# EAGLE design network driver (EAGLE 6.5.0)
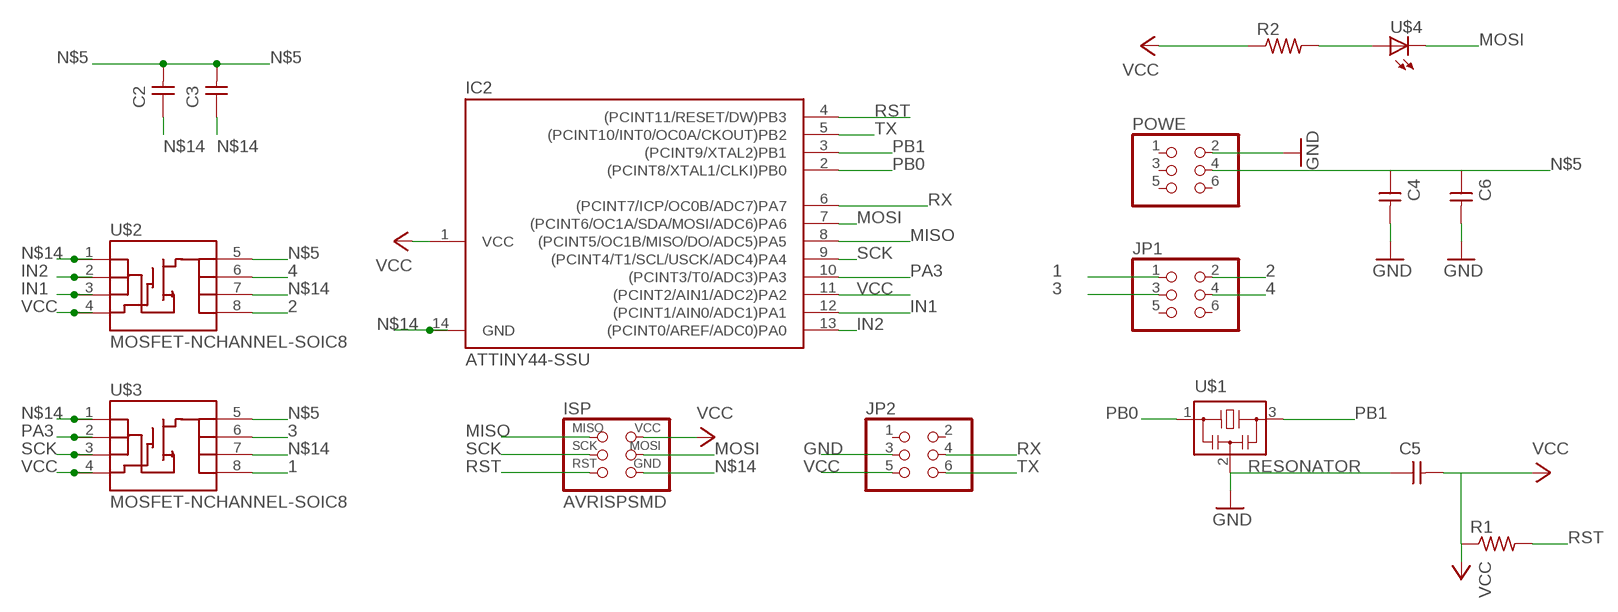
[diagram p0: schematic, sheet 1]

## Parts
C2  UNPOLARIZED_CAPACITOR1206  [1206]
C3  UNPOLARIZED_CAPACITOR1206  [1206]
C4  UNPOLARIZED_CAPACITOR1206  [1206]
C5  UNPOLARIZED_CAPACITOR1206  [1206]
C6  UNPOLARIZED_CAPACITOR1206  [1206]
IC2  ATTINY44-SSU  [SOIC14]
ISP  AVRISPSMD  [2X03SMD]
JP1  PINHD-2X3-SMD  [2X03SMD]
JP2  PINHD-2X3-SMD  [2X03SMD]
POWE  PINHD-2X3-SMD  [2X03SMD]
R1  RESISTOR1206  [1206]
R2  RESISTOR1206  [1206]
U$1  RESONATOR  [EFOBM]
U$2  MOSFET-NCHANNEL-SOIC8  [SO08]
U$3  MOSFET-NCHANNEL-SOIC8  [SO08]
U$4  LED1206  [1206]

## Nets
1: JP1.1 U$3.8(D)
2: JP1.2 U$2.8(D)
3: JP1.3 U$3.6(D)
4: JP1.4 U$2.6(D)
GND: C5.1 JP2.3 U$1.2
IN1: IC2.12((PCINT1/AIN0/ADC1)PA1) U$2.3(S)
IN2: IC2.13((PCINT0/AREF/ADC0)PA0) U$2.2(S)
MISO: IC2.8((PCINT5/OC1B/MISO/DO/ADC5)PA5) ISP.1(MISO)
MOSI: IC2.7((PCINT6/OC1A/SDA/MOSI/ADC6)PA6) ISP.4(MOSI) U$4.2(C)
N$3: R2.2 U$4.1(A)
N$5: C2.2 C3.2 C4.1 C6.1 POWE.4 U$2.5(D) U$3.5(D)
N$14: C2.1 C3.1 C4.2 C6.2 IC2.14(GND) ISP.6(GND) POWE.2 U$2.1(S) U$2.7(D) U$3.1(S) U$3.7(D) ; supply symbol labelled GND
PA3: IC2.10((PCINT3/T0/ADC3)PA3) U$3.2(S)
PB0: IC2.2((PCINT8/XTAL1/CLKI)PB0) U$1.1
PB1: IC2.3((PCINT9/XTAL2)PB1) U$1.3
RST: IC2.4((PCINT11/RESET/DW)PB3) ISP.5(RST) R1.2
RX: IC2.6((PCINT7/ICP/OC0B/ADC7)PA7) JP2.4
SCK: IC2.9((PCINT4/T1/SCL/USCK/ADC4)PA4) ISP.3(SCK) U$3.3(S)
TX: IC2.5((PCINT10/INT0/OC0A/CKOUT)PB2) JP2.6
VCC: C5.2 IC2.1(VCC) IC2.11((PCINT2/AIN1/ADC2)PA2) ISP.2(VCC) JP2.5 R1.1 R2.1 U$2.4(G) U$3.4(G)
Unconnected: JP1.5 JP1.6 JP2.1 JP2.2 POWE.1 POWE.3 POWE.5 POWE.6

## Library data of the parts
C2-C6 = 01_FAB_Hello:UNPOLARIZED_CAPACITOR: unpolarized_capacitor
IC2 = 01_FAB_Hello:ATTINY44
ISP = 01_FAB_Hello:AVRISP
JP1 JP2 POWE = 01_FAB_Hello:PINHD-2X3-SMD: PIN HEADER
R1 R2 = 01_FAB_Hello:RESISTOR
U$1 = 01_fab:RESONATOR
U$2 U$3 = 01_SparkFun:MOSFET-NCHANNEL-SOIC8: N-Channel MOSFET IRF9410 and NDS8434 are common, SOIC-8 parts.
U$4 = 01_FAB_Hello:LED

## Board
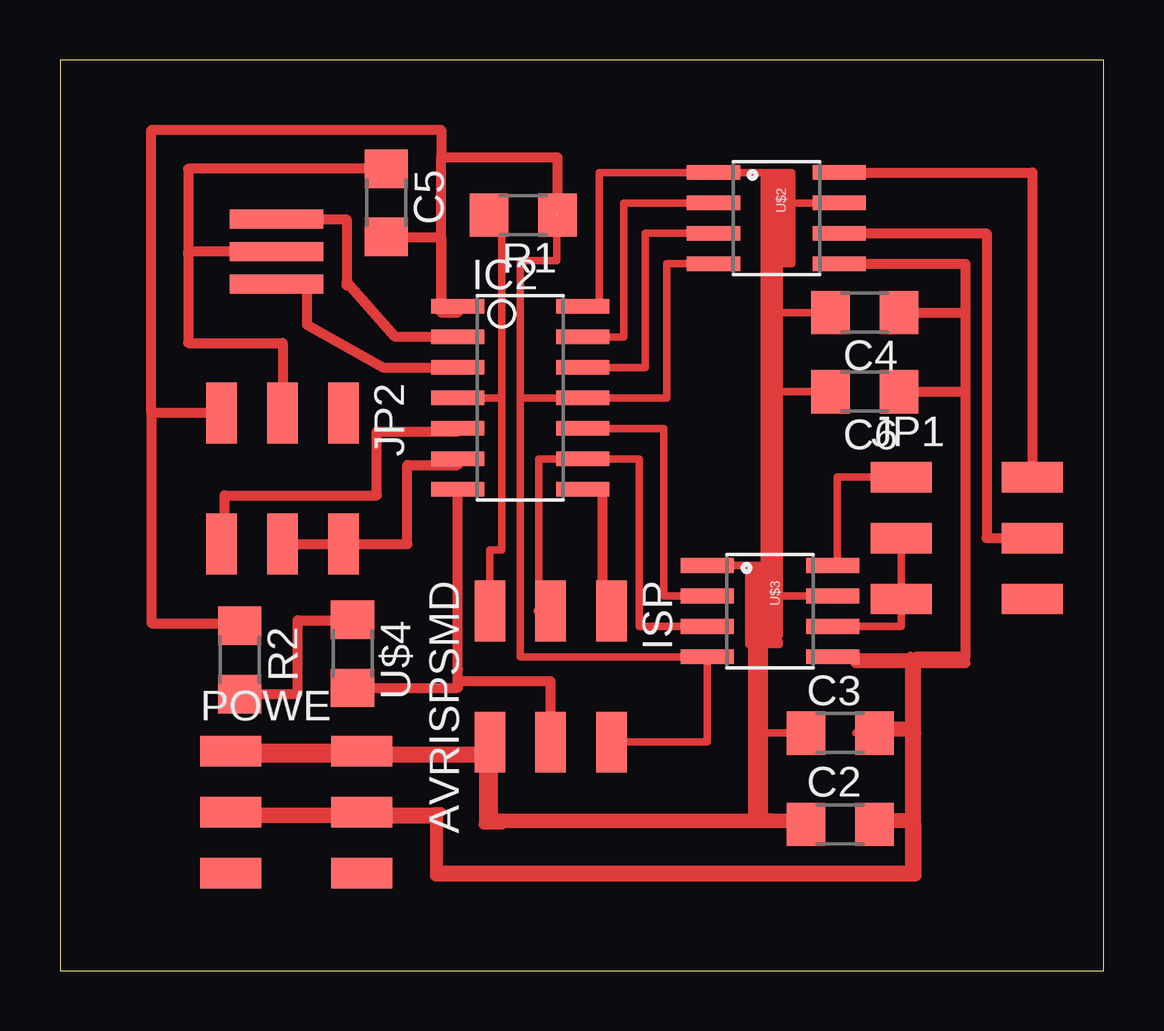
[diagram p1: board, top side]

Size 43.48 x 37.96 mm. Coordinates in mm from the lower left corner, seen from the top.
Outline: 0,0 43.48,0 43.48,37.96 0,37.96 0,0
Copper layers (1*16): Top 0.035mm / dielectric 1.5mm / Bottom 0.035mm
Design rules "default": minimum track width 10mil, minimum drill 24mil, track to track 8mil, track to pad 8mil, pad to pad 8mil, via to via 8mil, smd to smd 8mil, copper to edge 40mil, drill to drill 8mil, minimum pad ring 10mil, minimum via ring 8mil, stop-mask expansion 4mil, vias tented up to drill 0mil, thermal gap 10mil

### Footprints (pad centres in the part's own frame; a part is rotated, then mirrored left to right if it is on the bottom)
1206 = smd 1.6 x 1.803: 1 -1.422,0; 2 1.422,0
SOIC14 = smd 0.61 x 2.21: 1 -3.81,-2.603; 2 -2.54,-2.603; 3 -1.27,-2.603; 4 0,-2.603; 5 1.27,-2.603; 6 2.54,-2.603; 7 3.81,-2.603; 8 3.81,2.603; 9 2.54,2.603; 10 1.27,2.603; 11 0,2.603; 12 -1.27,2.603; 13 -2.54,2.603; 14 -3.81,2.603
2X03SMD = smd 2.54 x 1.27: 1 -2.54,2.54; 2 2.92,2.54; 3 -2.54,0; 4 2.92,0; 5 -2.54,-2.54; 6 2.92,-2.54
EFOBM = smd 0.8 x 3.9: 1 -1.35,0; 2 0,0; 3 1.35,0
SO08 = smd 0.61 x 2.21: 1 -1.905,-2.616; 2 -0.635,-2.616; 3 0.635,-2.616; 4 1.905,-2.616; 5 1.905,2.616; 6 0.635,2.616; 7 -0.635,2.616; 8 -1.905,2.616

### Placement (x,y rotation side)
C2  32.51,6.1 0 top
C3  32.51,9.91 0 top
C4  33.53,27.43 180 top
C5  13.59,32 270 top
C6  33.53,24.13 180 top
IC2  19.18,23.88 270 top
ISP  20.45,12.45 270 top
JP1  37.59,18.03 0 top
JP2  9.27,20.7 270 top
POWE  9.65,6.6 0 top
R1  19.3,31.5 180 top
R2  7.49,12.95 270 top
U$1  9.02,29.97 270 top
U$2  29.85,31.37 270 top
U$3  29.59,14.99 270 top
U$4  12.19,13.21 270 top

### Tracks (layer width: path | path; a pad name or v marks a point on that pad's centre or on a via)
1
  Top 0.305: U$3.8 32.39,16.89 32.39,20.57 JP1.1
2
  Top 0.406: U$2.8 40.51,33.27 JP1.2
3
  Top 0.305: U$3.6 35.05,14.35 JP1.3
4
  Top 0.406: U$2.6 38.61,30.73 38.61,18.03 JP1.4
GND
  Top 0.406: C5.1 5.33,33.43 5.33,29.97 | JP2.3 9.27,26.16 5.33,26.16 5.33,29.85 5.33,29.97 | U$1.2 5.33,29.97
IN1
  Top 0.305: U$2.3 24.38,30.73 24.38,25.15 IC2.12
IN2
  Top 0.305: U$2.2 23.5,32 23.5,26.42 IC2.13
MISO
  Top 0.406: ISP.1 22.61,14.99 22.61,20.07 IC2.8
MOSI
  Top 0.406: ISP.4 20.45,12.07 16.57,12.07 | 16.57,12.07 16.57,12.57 IC2.7 | U$4.2 16.57,11.79 16.57,12.07
N$2
  Top 0.305: 28.83,14.22 29.97,14.22 29.97,13.97 29.08,13.97 | 29.08,13.97 28.96,13.97 | 28.96,13.97 28.96,13.72 29.97,13.72 29.97,13.59 28.7,13.59 28.7,16.64 | 29.21,6.48 29.08,6.48 29.08,13.97 | 28.96,13.97 28.83,13.97 28.83,6.22
N$3
  Top 0.406: R2.2 9.91,11.53 9.91,14.61 12.19,14.61 U$4.1
N$5
  Top 0.305: 35.69,6.1 C2.2 | 33.15,9.91 C3.2 35.69,9.91 | U$3.5 35.43,13.08 35.69,13.08
  Top 0.406: U$2.5 37.72,29.46 37.72,27.43 | C4.1 37.72,27.43 | 37.72,27.43 37.72,24.13 | C6.1 37.72,24.13 | 37.72,24.13 37.72,13.08 | 37.72,13.08 35.69,13.08 35.69,9.91 35.69,6.1 35.69,3.94 15.62,3.94 15.62,6.35 | 15.62,6.35 15.62,6.6 POWE.4 6.99,6.6 | 13.72,6.35 15.62,6.35 | 35.43,4.32 35.43,13.08 | 33.15,12.83 37.72,12.83 37.72,13.08
N$6
  Top 0.406: 7.62,9.27 13.08,9.27 13.08,9.02 12.95,9.02
N$7
  Top 0.406: 12.57,6.35 7.49,6.35 7.49,6.48
N$8
  Top 0.406: 7.11,8.89 12.19,8.89 12.19,9.14
N$9
  Top 0.406: 13.33,8.89 17.78,8.89
N$10
  Top 0.406: 15.88,6.6 15.75,6.6 15.75,4.32
N$11
  Top 0.406: 15.88,4.19 35.56,4.19
N$12
  Top 0.406: 35.31,10.16 34.42,10.16
N$13
  Top 0.406: 35.31,6.35 34.8,6.35 34.8,6.22
N$14
  Top 0.305: 29.72,16.76 29.46,16.76 29.46,33.27 29.72,33.27 | ISP.6 17.91,6.86 17.91,6.1 18.42,6.1 29.59,6.1 29.59,6.35 29.46,6.35 29.46,6.22 | C2.1 29.34,6.1 29.34,9.91 | C3.1 29.34,9.91 | 29.34,9.91 29.34,15.62 | 29.34,15.62 29.34,16.64 | 29.34,16.64 29.34,16.89 | 29.34,16.89 U$3.1 | 29.97,14.35 29.97,16.89 29.59,16.89 | 29.59,16.89 29.34,16.89 | 29.59,16.89 29.59,14.35 29.72,14.35 | 29.85,14.35 29.72,14.35 | 29.72,14.35 29.72,16.64 | 29.72,16.64 29.34,16.64 | 29.34,16.64 28.96,16.64 | 28.96,16.64 28.96,16.76 29.21,16.76 29.21,14.35 28.96,14.35 28.96,16.64 | U$3.7 29.34,15.62 | IC2.14 22.48,27.69 22.48,33.27 U$2.1 29.34,33.27 29.34,32 | 29.34,32 29.34,27.43 | 29.34,27.43 29.34,24.13 | 29.34,24.13 29.34,16.89 | U$2.7 29.34,32 | C4.2 29.34,27.43 | C6.2 29.34,24.13 | 29.72,33.27 29.72,16.64 | 29.72,16.64 29.97,16.64 29.97,33.27 | 29.97,33.27 29.72,33.27 | 29.97,33.27 30.48,33.27 30.48,29.46 29.85,29.46 29.85,29.59 30.23,29.59 30.23,33.15
  Top 0.406: 17.65,8.51 17.65,6.1 18.42,6.1 | 17.91,6.22 17.91,6.1 | C2.1 31.09,6.35 29.59,6.35 18.03,6.35 18.03,9.53 ISP.6 17.91,9.14 POWE.2 | 17.91,6.86 17.91,6.48
PA3
  Top 0.305: U$3.2 25.15,15.62 25.15,22.61 IC2.10
PB0
  Top 0.406: U$1.1 11.94,31.32 11.94,28.7 | IC2.2 13.97,26.42 11.94,28.7 | 11.94,28.7 11.94,28.57
PB1
  Top 0.406: U$1.3 10.29,28.62 10.29,26.92 13.46,25.15 IC2.3
RST
  Top 0.305: R1.2 18.42,31.5 18.42,23.88 | 18.42,23.88 IC2.4 | ISP.5 17.91,17.53 18.42,17.53 18.42,23.88
RX
  Top 0.406: JP2.4 14.48,17.78 14.48,21.08 16.57,21.08 IC2.6
SCK
  Top 0.305: U$3.3 24.13,14.35 24.13,21.34 IC2.9 19.94,21.34 19.94,14.99
  Top 0.406: ISP.3 20.07,14.99 19.94,14.99
TX
  Top 0.406: JP2.6 6.86,17.78 6.86,19.81 13.21,19.81 13.21,22.48 16.57,22.48 IC2.5
VCC  (1 unrouted)
  Top 0.305: ISP.2 26.97,9.53 U$3.4 19.18,13.08 19.18,23.88 | 20.7,31.5 20.7,29.59 19.18,29.59 19.18,23.88 | 19.18,23.88 IC2.11 25.27,23.88 25.27,29.46 U$2.4
  Top 0.406: C5.2 15.88,30.58 15.88,27.43 16.57,27.43 IC2.1 15.88,27.69 15.88,33.91 | 15.88,33.91 15.88,35.05 3.81,35.05 3.81,23.24 | 15.88,33.91 20.73,33.91 R1.1 | JP2.5 3.81,23.24 | 3.81,23.24 3.81,14.48 7.49,14.48 R2.1